# EAGLE schematic ArduinoZeroV4.0 (EAGLE 9.5.1)

## Sheet 1 of 3
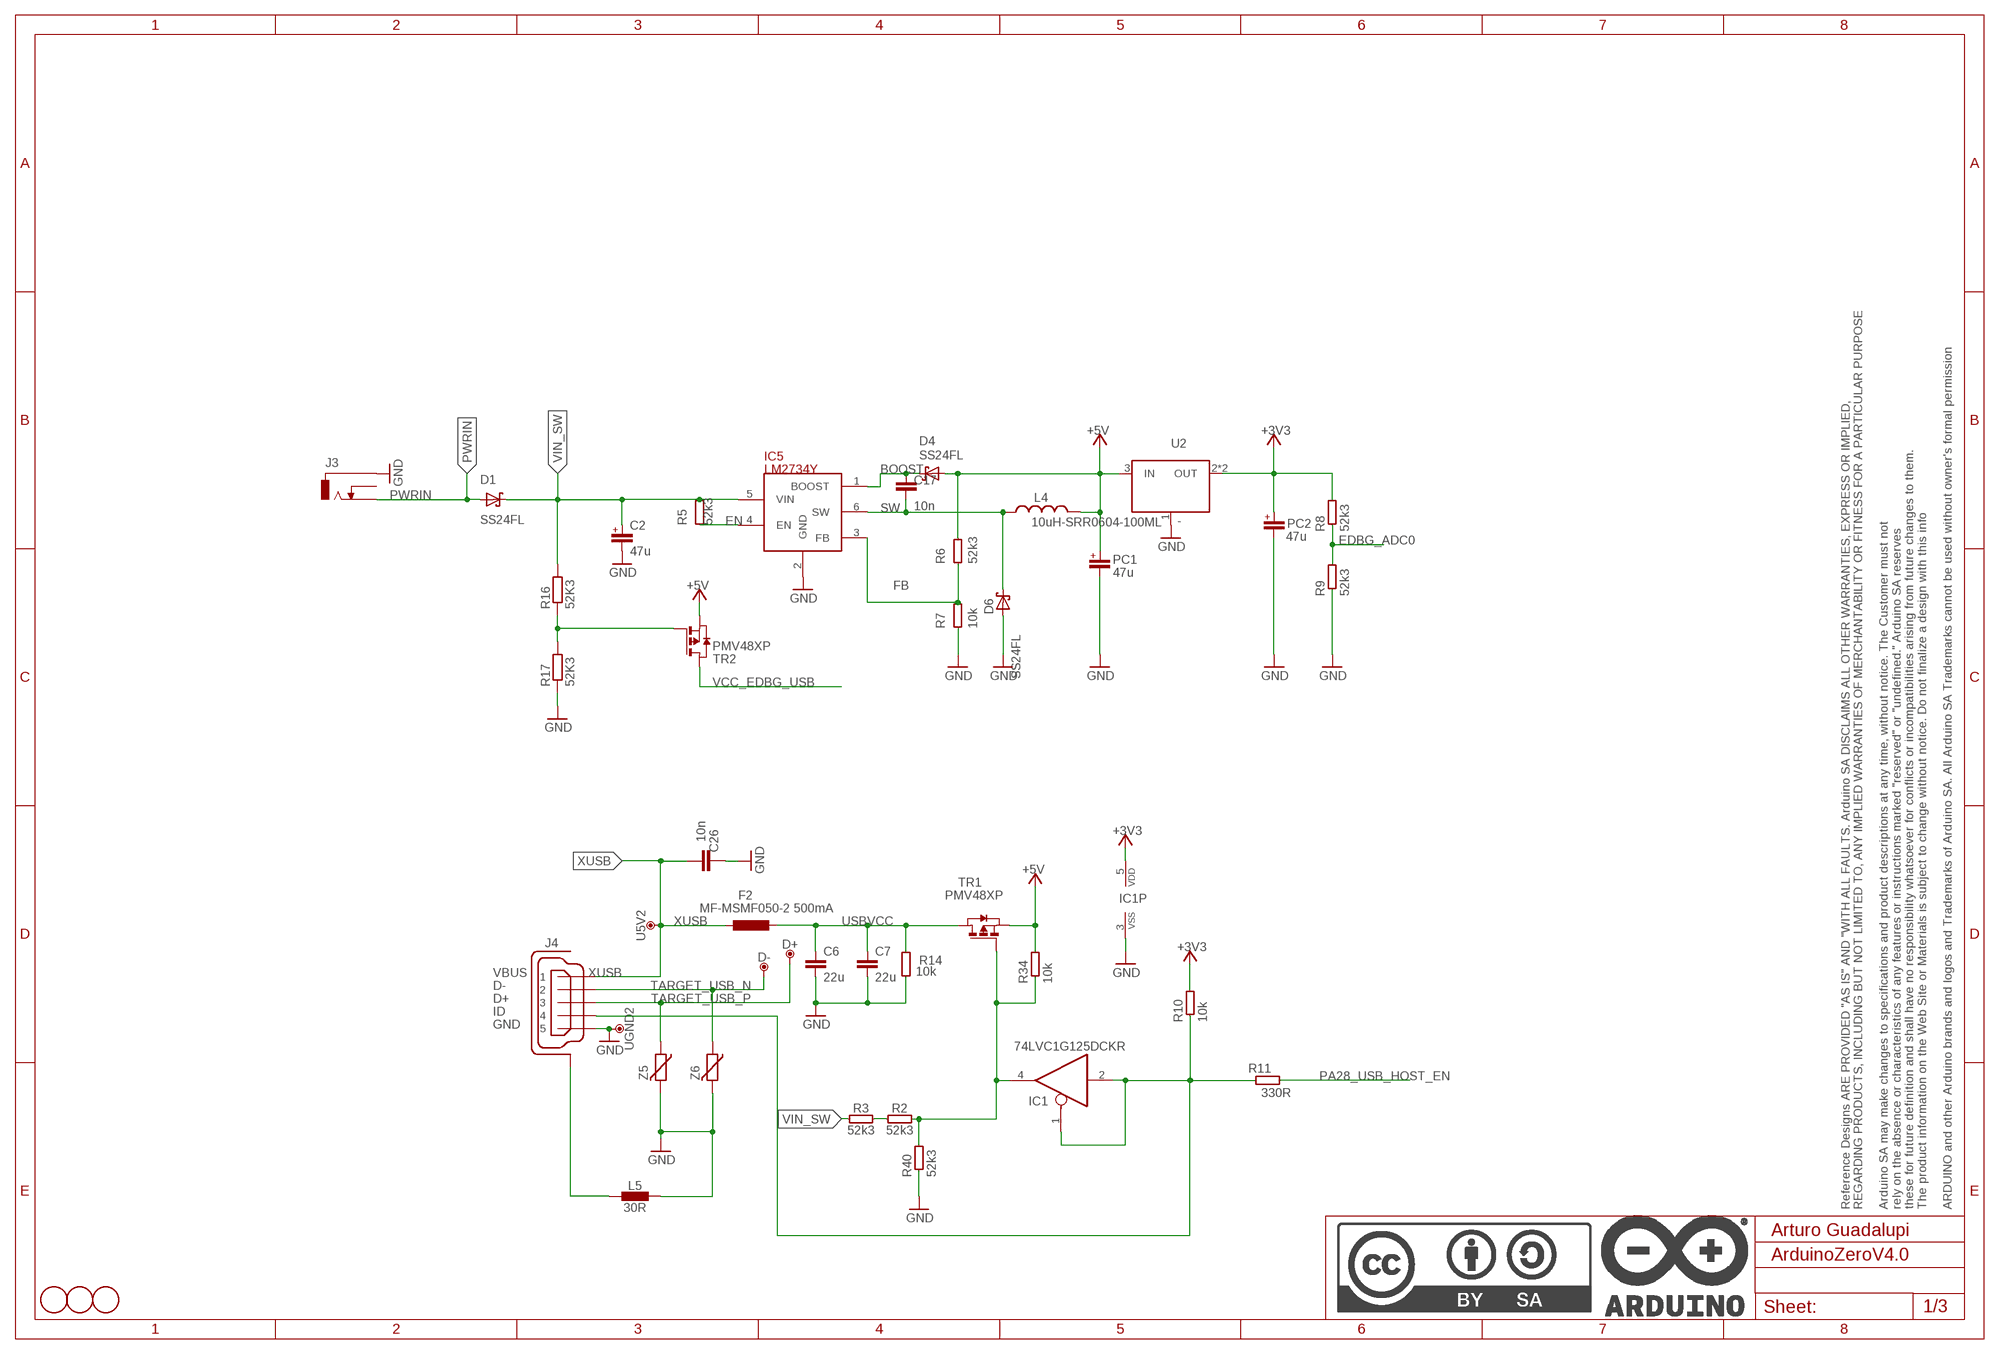
[diagram p0: schematic, sheet 1]

### Parts
C2  47u  C+-47UFPAN-D  [PANASONIC_D]
C6  22u  C-22U-0805  [0805-R2013X50N]
C7  22u  C-22U-0805  [0805-R2013X50N]
C17  10n  C-10NF-0603  [0603-1608X90N]
C26  10n  0142_10NF_0603  [C0603-ROUND]
D1  SS24FL  [SOD123F]
D4  SS24FL  [SOD123F]
D6  SS24FL  [SOD123F]
D+  DNP  TPTP-1.00MM  [TP-1.00MM]
D-  DNP  TPTP-1.00MM  [TP-1.00MM]
F2  MF-MSMF050-2 500mA  0002_MF-MSMF050-2  [L1812]
FD1  DNP  FIDUCIAL-1.5MM  [FD-1-1.5]
FD2  DNP  FIDUCIAL-1.5MM  [FD-1-1.5]
FD3  DNP  FIDUCIAL-1.5MM  [FD-1-1.5]
IC1  74LVC1G125DCKR  SN74LVC1G125DCKR  [SC70-5]
IC5  LM2734Y  0179_LM2734YMK  [SOT23-6]
J3  -  BARRELLG  [POWERSUPPLY_DC-21MM]
J4  -  USB-MICRO  [ZX62-AB-5PA]
L4  10uH-SRR0604-100ML  0031_SRR0604-100ML  [SRR0604]
L5  30R  FERRITE-30R0805  [0805-R2013X50N]
PC1  47u  C+-47UFPAN-D  [PANASONIC_D]
PC2  47u  C+-47UFPAN-D  [PANASONIC_D]
R2  52k3  R-52K3-0603  [C0603]
R3  52k3  R-52K3-0603  [C0603]
R5  52k3  R-52K3-0603  [C0603]
R6  52k3  R-52K3-0603  [C0603]
R7  10k  R-52K3-0603  [C0603]
R8  52k3  R-52K3-0603  [C0603]
R9  52k3  R-52K3-0603  [C0603]
R10  10k  R-10K-0603  [C0603]
R11  330R  R-330R-0603  [C0603]
R14  10k  R-10K-0603  [C0603]
R16  52K3  0180_52K3_0603  [R0603-ROUND]
R17  52K3  0180_52K3_0603  [R0603-ROUND]
R34  10k  R-10K-0603  [C0603]
R40  52k3  R-52K3-0603  [C0603]
TR1  PMV48XP  [SOT-23]
TR2  PMV48XP  [SOT-23]
U2  -  LDO-3.3T3SOT223  [SOT223]
U5V2  DNP  TPTP-1.00MM  [TP-1.00MM]
U$4  DNP  A3-FRAME  [FRAME]
UGND2  DNP  TPTP-1.00MM  [TP-1.00MM]
Z5  -  VARISTOR  [C0603]
Z6  -  VARISTOR  [C0603]

### Nets
+3V3: IC1.5(VDD) PC2.+ R8.2 R10.2 U2.2(OUT) U2.4(OUT) ; also sheet 2,3
+5V [usbvcc]: D4.A L4.P$2 PC1.+ R6.1 R34.2 TR1.2(S) TR2.2(S) U2.3(IN) ; also sheet 2
BOOST: C17.1 D4.C IC5.1(BOOST)
EDBG_ADC0: R8.1 R9.2 ; also sheet 3
EN: IC5.4(EN) R5.2
FB: IC5.3(FB) R6.2 R7.1
GND [gnd]: C2.- C6.2 C7.2 C26.2 D6.A IC1.3(VSS) IC5.2(GND) J3.-1 J3.-2 J3.-3 J4.5 L5.2 PC1.- PC2.- R7.2 R9.1 R14.1 R17.1 R40.1 U2.1(GND/ADJ) UGND2.X Z5.2 Z6.2 ; also sheet 2,3
N$4: IC1.4(O) R2.2 R34.1 R40.2 TR1.3(G)
N$5: R2.1 R3.2
N$7: IC1.1(OE) IC1.2(I) J4.4 R10.1 R11.1
N$15 [gnd]: J4.6(SH) J4.7(SH) J4.8(SH) J4.9(SH) J4.10(SH) J4.11(SH) L5.1
N$16: R16.1 R17.2 TR2.3(G)
PA28_USB_HOST_EN: R11.2 ; also sheet 2
PWRIN [USB]: D1.A J3.+1 J3.+2 J3.+3 ; also sheet 2
SW [USB]: C17.2 D6.C IC5.6(SW) L4.P$1
TARGET_USB_N [USBpair]: D-.X J4.2 Z6.1 ; also sheet 2
TARGET_USB_P [USBpair]: D+.X J4.3 Z5.1 ; also sheet 2
USBVCC [usbvcc]: C6.1 C7.1 F2.1 R14.2 TR1.1(D)
VCC_EDBG_USB: TR2.1(D) ; also sheet 3
VIN_SW [USB]: C2.+ D1.C IC5.5(VIN) R3.1 R5.1 R16.2
XUSB [usbvcc]: C26.1 F2.2 J4.1 U5V2.X
Unconnected: J3.E1 J3.E2 J3.E3

### Notes on the sheet
- Arturo Guadalupi

## Sheet 2 of 3
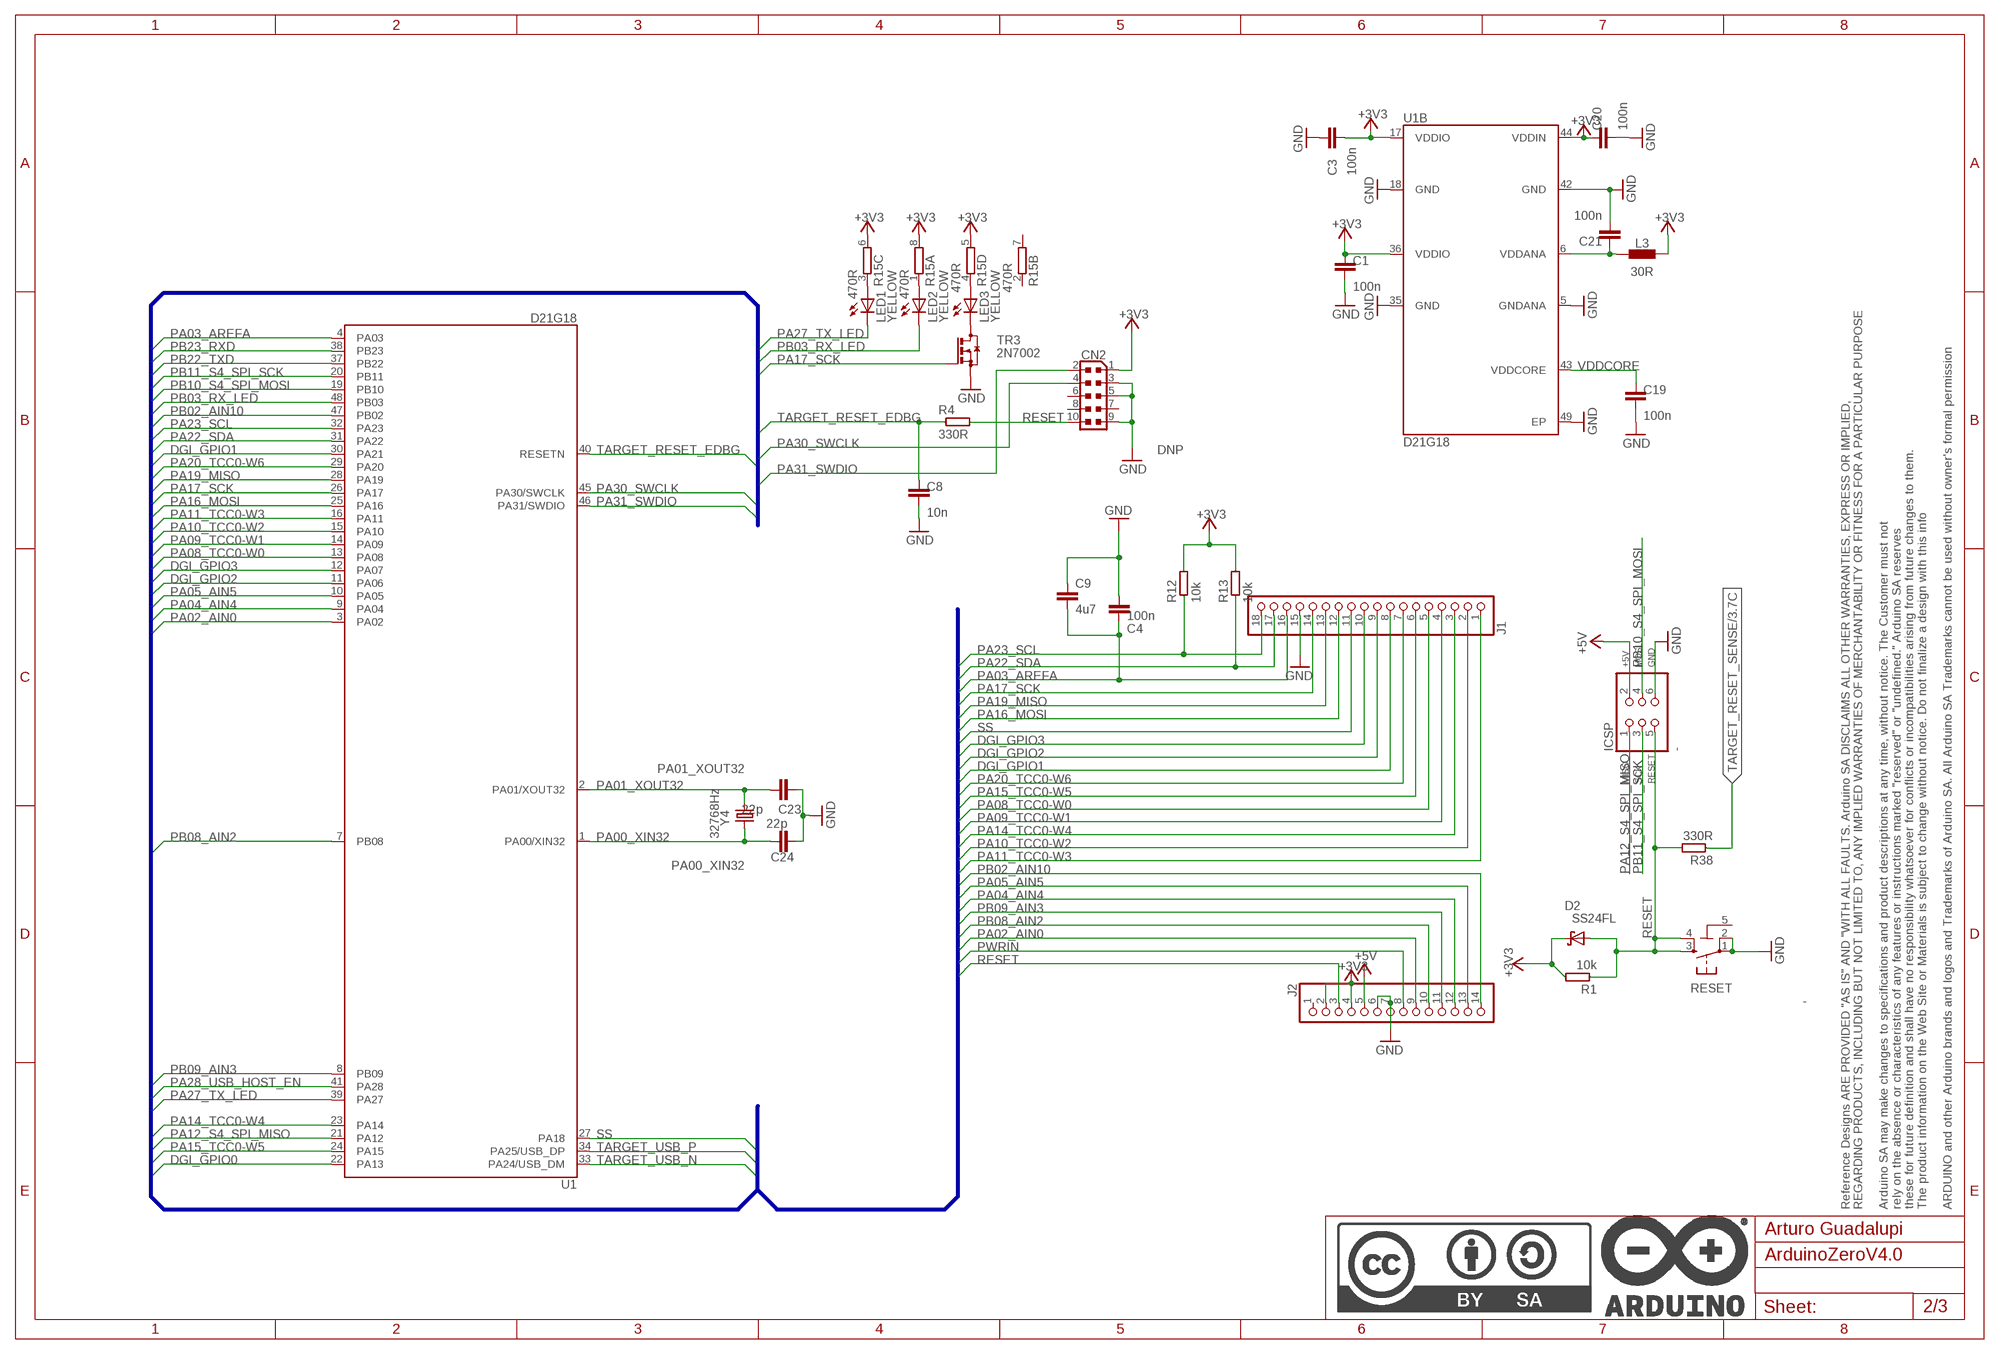
[diagram p1: schematic, sheet 2]

### Parts
C1  100n  C-100NF-0603  [0603-1608X90N]
C3  100n  C-100NF-0603  [0603-1608X90N]
C4  100n  C-100NF-0402  [0402-1005X55N]
C8  10n  C-10NF-0603  [0603-1608X90N]
C9  4u7  C-4.7UF-0603  [0603-1608X90N]
C19  100n  C-100NF-0603  [0603-1608X90N]
C20  100n  C-100NF-0603  [0603-1608X90N]
C21  100n  C-100NF-0603  [0603-1608X90N]
C23  22p  C-22PF-0603  [0603-1608X90N]
C24  22p  C-22PF-0603  [0603-1608X90N]
CN2  DNP  JTAG_CONNECTOR-DNP  [PINHEAD_2X05_127]
D2  SS24FL  [SOD123F]
ICSP  -  PINHD-2X03-ICSPTH  [2X03]
J1  -  PINHD-1X18-FEMALE-CUSTOM_OLD  [1X18-CUSTOM]
J2  -  PINHD-1X14-FEMALE-CUSTOM_OLD  [1X14-CUSTOM]
L3  30R  FERRITE-30R080515MR0805  [0805-R2013X50N]
LED1  YELLOW  LED-YELLOW-0805  [CHIPLED_0805]
LED2  YELLOW  LED-YELLOW-0805  [CHIPLED_0805]
LED3  YELLOW  LED-YELLOW-0805  [CHIPLED_0805]
R1  10k  R-10K-0603  [C0603]
R4  330R  R-330R-0603  [C0603]
R12  10k  R-10K-0603  [C0603]
R13  10k  R-10K-0603  [C0603]
R15  470R  4R-N-470RCAY16  [CAY16]
R38  330R  R-330R-0603  [C0603]
RESET  -  TACTILE2  [TS42]
TR3  2N7002  2N7002T-SOT23-SOT23  [SOT23]
U1  D21G18  ATSAMD21G18A-48QFN  [QFN50P700X700X90-49XN-EPSQ515]
U$5  DNP  A3-FRAME  [FRAME]
Y4  32768Hz  32.768KHZ  [ABS07]

### Nets
+3V3: C1.1 C3.2 C20.1 CN2.1 D2.C J2.2 J2.4 L3.2 R1.2 R12.2 R13.2 R15.5 R15.6 R15.8 U1.17(VDDIO) U1.36(VDDIO) U1.44(VDDIN) ; also sheet 1,3
+5V [usbvcc]: ICSP.2 J2.5 ; also sheet 1
DGI_GPIO0: U1.22(PA13) ; also sheet 3
DGI_GPIO1: J1.8 U1.30(PA21) ; also sheet 3
DGI_GPIO2: J1.9 U1.11(PA06) ; also sheet 3
DGI_GPIO3: J1.10 U1.12(PA07) ; also sheet 3
GND [gnd]: C1.2 C3.1 C4.2 C8.2 C9.1 C19.2 C20.2 C21.2 C23.1 C24.1 CN2.3 CN2.5 CN2.9 ICSP.6 J1.15 J2.6 J2.7 RESET.1 RESET.2 TR3.2(S) U1.5(GNDANA) U1.18(GND) U1.35(GND) U1.42(GND) U1.49(EP) ; also sheet 1,3
N$3: LED3.C TR3.3(D)
N$10: C21.1 L3.1 U1.6(VDDANA)
N$20: LED1.A R15.3
N$21: LED2.A R15.1
N$22: LED3.A R15.4
PA00_XIN32: C24.2 U1.1(PA00/XIN32) Y4.1
PA01_XOUT32: C23.2 U1.2(PA01/XOUT32) Y4.2
PA02_AIN0: J2.9 U1.3(PA02)
PA03_AREFA: C4.1 C9.2 J1.16 U1.4(PA03)
PA04_AIN4: J2.12 U1.9(PA04)
PA05_AIN5: J2.13 U1.10(PA05)
PA08_TCC0-W0: J1.5 U1.13(PA08)
PA09_TCC0-W1: J1.4 U1.14(PA09)
PA10_TCC0-W2: J1.2 U1.15(PA10)
PA11_TCC0-W3: J1.1 U1.16(PA11)
PA12_S4_SPI_MISO: ICSP.1 U1.21(PA12)
PA14_TCC0-W4: J1.3 U1.23(PA14)
PA15_TCC0-W5: J1.6 U1.24(PA15)
PA16_MOSI: J1.12 U1.25(PA16) ; also sheet 3
PA17_SCK: J1.14 TR3.1(G) U1.26(PA17) ; also sheet 3
PA19_MISO: J1.13 U1.28(PA19) ; also sheet 3
PA20_TCC0-W6: J1.7 U1.29(PA20)
PA22_SDA: J1.17 R13.1 U1.31(PA22) ; also sheet 3
PA23_SCL: J1.18 R12.1 U1.32(PA23) ; also sheet 3
PA27_TX_LED: LED1.C U1.39(PA27)
PA28_USB_HOST_EN: U1.41(PA28) ; also sheet 1
PA30_SWCLK: CN2.4 U1.45(PA30/SWCLK) ; also sheet 3
PA31_SWDIO: CN2.2 U1.46(PA31/SWDIO) ; also sheet 3
PB02_AIN10: J2.14 U1.47(PB02)
PB03_RX_LED: LED2.C U1.48(PB03)
PB08_AIN2: J2.10 U1.7(PB08)
PB09_AIN3: J2.11 U1.8(PB09)
PB10_S4_SPI_MOSI: ICSP.4 U1.19(PB10)
PB11_S4_SPI_SCK: ICSP.3 U1.20(PB11)
PB22_TXD: U1.37(PB22) ; also sheet 3
PB23_RXD: U1.38(PB23) ; also sheet 3
PWRIN [USB]: J2.8 ; also sheet 1
RESET: CN2.10 D2.A ICSP.5 J2.3 R1.1 R4.2 R38.2 RESET.3 RESET.4
SS: J1.11 U1.27(PA18) ; also sheet 3
TARGET_RESET_EDBG: C8.1 R4.1 U1.40(RESETN) ; also sheet 3
TARGET_RESET_SENSE: R38.1 ; also sheet 3
TARGET_USB_N [USBpair]: U1.33(PA24/USB_DM) ; also sheet 1
TARGET_USB_P [USBpair]: U1.34(PA25/USB_DP) ; also sheet 1
VDDCORE: C19.1 U1.43(VDDCORE)
Unconnected: CN2.6 CN2.7 CN2.8 J2.1 R15.2 R15.7

### Buses
+3V3,+5V,BD-,BD+,BOOST,DGI_GPIO0,DGI_GPIO1,DGI_GPIO2,DGI_GPIO3,EDBG_ADC0,EDBG_FORCE_BOOT,EN,FB,GND,N$1,N$2,N$3,N$4,N$6,N$7,N$10,N$15,N$16,N$18,N$19,N$20,N$21,N$22,N$23,N$24,N$25,N$26,N$27,N$34,N$37,N$38,N$39,N$40,N$41,N$42,N$43,N$44,N$45,N$57,N$58,N$59,N$60,N$61,N$67,N$68,PA00_XIN32,PA01_XOUT32,PA02_AIN0,PA03_AREFA,PA04_AIN4,PA05_AIN5,PA08_TCC0-W0,PA09_TCC0-W1,PA10_TCC0-W2,PA11_TCC0-W3,PA12_S4_SPI_MISO,PA14_TCC0-W4,PA15_TCC0-W5,PA16_MOSI,PA17_SCK,PA19_MISO,PA20_TCC0-W6,PA22_SDA,PA23_SCL,PA27_TX_LED,PA28_USB_HOST_EN,PA30_SWCLK,PA31_SWDIO,PB02_AIN10,PB03_RX_LED,PB08_AIN2,PB09_AIN3,PB10_S4_SPI_MOSI,PB11_S4_SPI_SCK,PB22_TXD,PB23_RXD,POWER_LED_CTRL,PWRIN,RESET,SS,STATUS_LED_CTRL,SW,TARGET_RESET_EDBG,TARGET_RESET_SENSE,TARGET_USB_N,TARGET_USB_P,USBVCC,VCC_EDBG_3V3,VCC_EDBG_USB,VDDCORE,VIN_SW,XUSB,XVCC

### Notes on the sheet
- Arturo Guadalupi

## Sheet 3 of 3
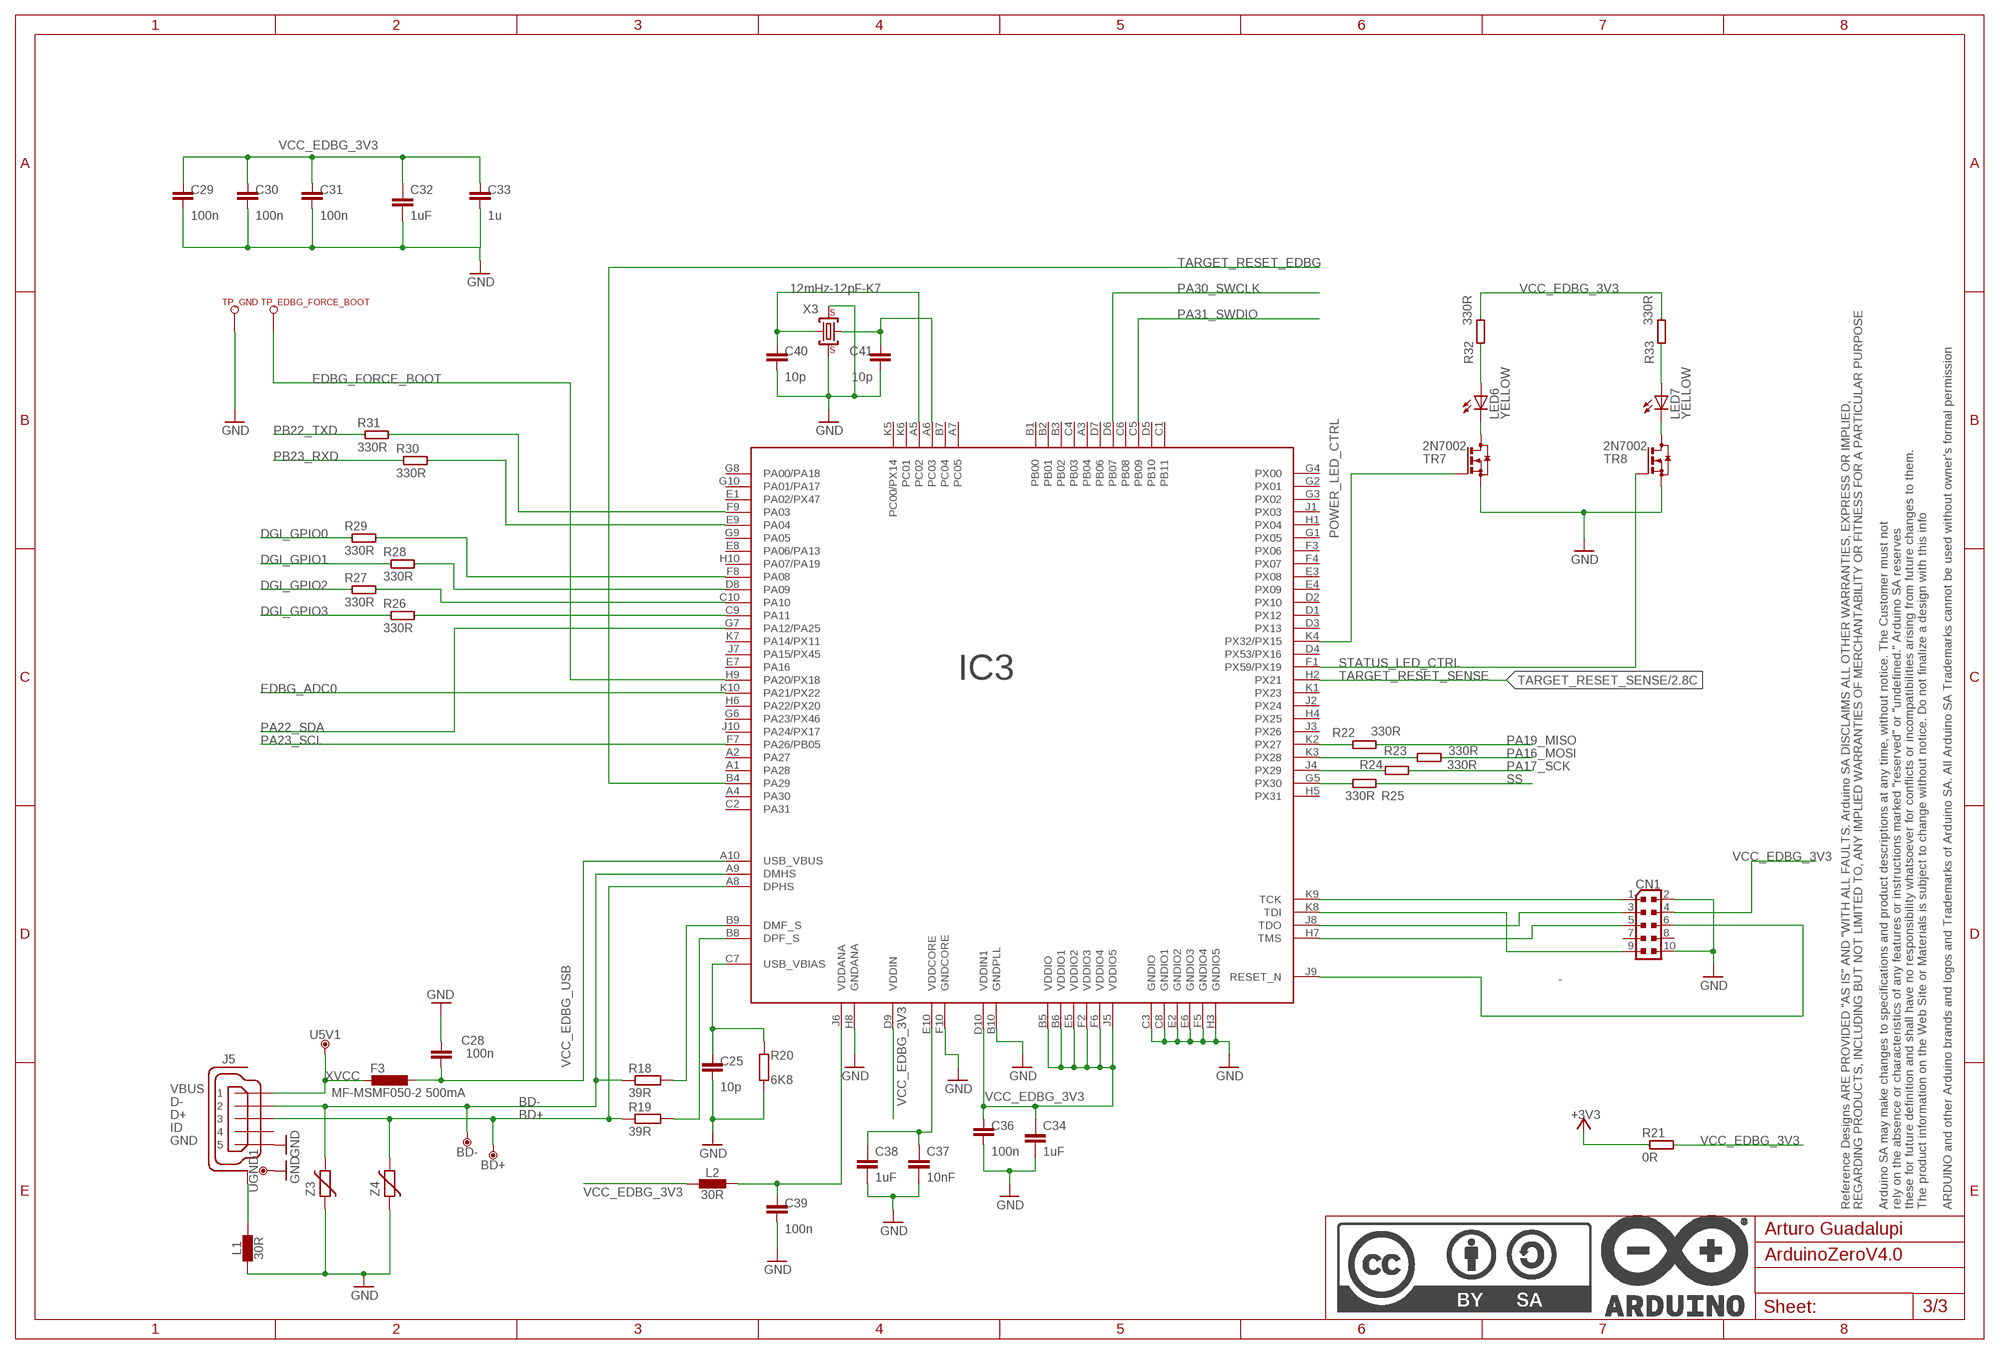
[diagram p2: schematic, sheet 3]

### Parts
BD+  DNP  TPTP-1.00MM  [TP-1.00MM]
BD-  DNP  TPTP-1.00MM  [TP-1.00MM]
C25  10p  C-10P-0603  [0603-1608X90N]
C28  100n  C-100NF-0603  [0603-1608X90N]
C29  100n  C-100NF-0603  [0603-1608X90N]
C30  100n  C-100NF-0603  [0603-1608X90N]
C31  100n  C-100NF-0603  [0603-1608X90N]
C32  1uF  0006_1UF_0603/GRM188R61E105KA12D  [C0603-ROUND]
C33  1u  C-1UF-0603  [0603-1608X90N]
C34  1uF  0006_1UF_0603/GRM188R61E105KA12D  [C0603-ROUND]
C36  100n  C-100NF-0603  [0603-1608X90N]
C37  10nF  0408_1NF_0603  [C0603-ROUND]
C38  1uF  0006_1UF_0603/GRM188R61E105KA12D  [C0603-ROUND]
C39  100n  C-100NF-0603  [0603-1608X90N]
C40  10p  C-10P-0603  [0603-1608X90N]
C41  10p  C-10P-0603  [0603-1608X90N]
CN1  -  JTAG_CONNECTOR-ROUND  [PINHEAD_2X05_127]
F3  MF-MSMF050-2 500mA  0002_MF-MSMF050-2  [L1812]
IC3  1791_AT32UC3A4256HHB-C1UR  [VFBGA100]
J5  -  USB-MICRO  [ZX62-AB-5PA]
L1  30R  FERRITE-30R080515MR0805  [0805-R2013X50N]
L2  30R  FERRITE-30R080515MR0805  [0805-R2013X50N]
LED6  YELLOW  LED-YELLOW-0805  [CHIPLED_0805]
LED7  YELLOW  LED-YELLOW-0805  [CHIPLED_0805]
R18  39R  0176_39_R_0603  [R0603-ROUND]
R19  39R  0176_39_R_0603  [R0603-ROUND]
R20  6K8  0164_6K8_0603  [R0603-ROUND]
R21  0R  R-0R-0603  [C0603]
R22  330R  R-330R-0603  [C0603]
R23  330R  R-330R-0603  [C0603]
R24  330R  R-330R-0603  [C0603]
R25  330R  R-330R-0603  [C0603]
R26  330R  R-330R-0603  [C0603]
R27  330R  R-330R-0603  [C0603]
R28  330R  R-330R-0603  [C0603]
R29  330R  R-330R-0603  [C0603]
R30  330R  R-330R-0603  [C0603]
R31  330R  R-330R-0603  [C0603]
R32  330R  R-330R-0603  [C0603]
R33  330R  R-330R-0603  [C0603]
TP_EDBG_FORCE_BOOT  TP_SP  [TP-SP]
TP_GND  TP_SP  [TP-SP]
TR7  2N7002  2N7002T-SOT23-SOT23  [SOT23]
TR8  2N7002  2N7002T-SOT23-SOT23  [SOT23]
U5V1  DNP  TPTP-1.00MM  [TP-1.00MM]
U$6  DNP  A3-FRAME  [FRAME]
UGND1  DNP  TPTP-1.00MM  [TP-1.00MM]
X3  12mHz-12pF-K7  0396_12MHZ-12PF-K7  [CRYSTAL-3.2-2.5]
Z3  -  VARISTOR  [C0603]
Z4  -  VARISTOR  [C0603]

### Nets
+3V3: R21.1 ; also sheet 1,2
BD+ [USBpair]: BD+.X IC3.A8(DPHS) J5.3 R19.1 Z4.2
BD- [USBpair]: BD-.X IC3.A9(DMHS) J5.2 R18.1 Z3.2
DGI_GPIO0: R29.1 ; also sheet 2
DGI_GPIO1: R28.1 ; also sheet 2
DGI_GPIO2: R27.1 ; also sheet 2
DGI_GPIO3: R26.1 ; also sheet 2
EDBG_ADC0: IC3.K10(PA21/PX22) ; also sheet 1
EDBG_FORCE_BOOT: IC3.H9(PA20/PX18) TP_EDBG_FORCE_BOOT.X(TESTP)
GND [gnd]: C25.2 C28.2 C29.2 C30.2 C31.2 C32.2 C33.2 C34.2 C36.2 C37.2 C38.2 C39.2 C40.2 C41.2 CN1.2 CN1.10 IC3.B10(GNDPLL) IC3.C3(GNDIO) IC3.C8(GNDIO1) IC3.E2(GNDIO2) IC3.E6(GNDIO3) IC3.F5(GNDIO4) IC3.F10(GNDCORE) IC3.H3(GNDIO5) IC3.H8(GNDANA) J5.5 L1.1 R20.1 TP_GND.X(TESTP) TR7.2(S) TR8.2(S) UGND1.X X3.2(GND) X3.4(GND) Z3.1 Z4.1 ; also sheet 1,2
N$1: LED6.C TR7.3(D)
N$2: LED7.C TR8.3(D)
N$6 [gnd]: J5.6(SH) J5.7(SH) J5.8(SH) J5.9(SH) J5.10(SH) J5.11(SH) L1.2
N$18: IC3.B9(DMF_S) R18.2
N$19: IC3.B8(DPF_S) R19.2
N$23: C25.1 IC3.C7(USB_VBIAS) R20.2
N$24: C41.1 IC3.A6(PC03) X3.1(C1)
N$25: C40.1 IC3.A5(PC02) X3.3(C2)
N$26: C37.1 C38.1 IC3.E10(VDDCORE)
N$27: C39.1 IC3.J6(VDDANA) L2.2
N$34: IC3.K2(PX27) R22.1
N$37: IC3.K3(PX28) R23.1
N$38: IC3.J4(PX29) R24.1
N$39: IC3.G5(PX30) R25.1
N$40: IC3.C9(PA11) R26.2
N$41: IC3.C10(PA10) R27.2
N$42: IC3.D8(PA09) R28.2
N$43: IC3.F8(PA08) R29.2
N$44: IC3.E9(PA04) R30.2
N$45: IC3.F9(PA03) R31.2
N$57: CN1.1 IC3.K9(TCK)
N$58: CN1.9 IC3.K8(TDI)
N$59: CN1.3 IC3.J8(TDO)
N$60: CN1.5 IC3.H7(TMS)
N$61: CN1.6 IC3.J9(RESET_N)
N$67: LED6.A R32.1
N$68: LED7.A R33.1
PA16_MOSI: R23.2 ; also sheet 2
PA17_SCK: R24.2 ; also sheet 2
PA19_MISO: R22.2 ; also sheet 2
PA22_SDA: IC3.G7(PA12/PA25) ; also sheet 2
PA23_SCL: IC3.F7(PA26/PB05) ; also sheet 2
PA30_SWCLK: IC3.D6(PB07) ; also sheet 2
PA31_SWDIO: IC3.C5(PB09) ; also sheet 2
PB22_TXD: R31.1 ; also sheet 2
PB23_RXD: R30.1 ; also sheet 2
POWER_LED_CTRL: IC3.K4(PX32/PX15) TR7.1(G)
SS: R25.2 ; also sheet 2
STATUS_LED_CTRL: IC3.F1(PX59/PX19) TR8.1(G)
TARGET_RESET_EDBG: IC3.B4(PA29) ; also sheet 2
TARGET_RESET_SENSE: IC3.H2(PX21) ; also sheet 2
VCC_EDBG_3V3: C29.1 C30.1 C31.1 C32.1 C33.1 C34.1 C36.1 CN1.4 IC3.B5(VDDIO) IC3.B6(VDDIO1) IC3.D9(VDDIN) IC3.D10(VDDIN1) IC3.E5(VDDIO2) IC3.F2(VDDIO3) IC3.F6(VDDIO4) IC3.J5(VDDIO5) L2.1 R21.2 R32.2 R33.2
VCC_EDBG_USB: C28.1 F3.1 IC3.A10(USB_VBUS) ; also sheet 1
XVCC [usbvcc]: F3.2 J5.1 U5V1.X
Unconnected: CN1.7 CN1.8 IC3.A1(PA28) IC3.A2(PA27) IC3.A3(PB04) IC3.A4(PA30) IC3.A7(PC05) IC3.B1(PB00) IC3.B2(PB01) IC3.B3(PB02) IC3.B7(PC04) IC3.C1(PB11) IC3.C2(PA31) IC3.C4(PB03) IC3.C6(PB08) IC3.D1(PX12) IC3.D2(PX10) IC3.D3(PX13) IC3.D4(PX53/PX16) IC3.D5(PB10) IC3.D7(PB06) IC3.E1(PA02/PX47) IC3.E3(PX08) IC3.E4(PX09) IC3.E7(PA16) IC3.E8(PA06/PA13) IC3.F3(PX06) IC3.F4(PX07) IC3.G1(PX05) IC3.G2(PX01) IC3.G3(PX02) IC3.G4(PX00) IC3.G6(PA23/PX46) IC3.G8(PA00/PA18) IC3.G9(PA05) IC3.G10(PA01/PA17) IC3.H1(PX04) IC3.H4(PX25) IC3.H5(PX31) IC3.H6(PA22/PX20) IC3.H10(PA07/PA19) IC3.J1(PX03) IC3.J2(PX24) IC3.J3(PX26) IC3.J7(PA15/PX45) IC3.J10(PA24/PX17) IC3.K1(PX23) IC3.K5(PC00/PX14) IC3.K6(PC01) IC3.K7(PA14/PX11) J5.4

### Notes on the sheet
- Arturo Guadalupi

## Power pins joined to a net without a drawn wire
5-GND: RESET.5(5-GND)

## Library data of the parts
BD+ BD- D+ D- U5V1 U5V2 UGND1 UGND2 = Arduino-utility:TP: Testpoint; CODE-ARDUINO: DNP; DATASHEET: DNP; DISTRIBUTOR-LINK: DNP; DISTRIBUTOR-PN: DNP; MANUFACTURER: DNP; MANUFACTURER-PN: DNP
C1 C3 C19-C21 C28-C31 C36 C39 = Arduino-rcl:C: SMD Capacitor; CODE-ARDUINO: 0015; DATASHEET: http://search.murata.co.jp/Ceramy/image/img/A01X/G101/ENG/GRM188R71C104KA01-01.pdf; DISTRIBUTOR-LINK: https://www.digikey.com/product-detail/en/murata-electronics-north-america/GRM188R71C104KA01D/490-1532-1-ND/587771; DISTRIBUTOR-PN: 490-1532-2-ND; MANUFACTURER: Murata; MANUFACTURER-PN: GRM188R71C104KA01D; NOTE: -; PN-ALTERNATIVE1: NMC0603Y5V104Z25TRPF; PN-ALTERNATIVE2: C1608F104Z500NT; PN-ALTERNATIVE3: C0603C104K3RAC7411; PN-ALTERNATIVE4: 06035D104KAT2A; PN-ALTERNATIVE5: 0603B104K500CT
C2 PC1 PC2 = Arduino-rcl:C+: Polarized Capacitor; CODE-ARDUINO: 0113; DATASHEET: https://industrial.panasonic.com/cdbs/www-data/pdf/RDE0000/DME0000COL90.pdf; DISTRIBUTOR-LINK: https://www.digikey.com/product-detail/en/panasonic-electronic-components/EEE-1EA470WP/PCE3908CT-ND/766284; DISTRIBUTOR-PN: PCE3908CT-ND; MANUFACTURER: Panasonic; MANUFACTURER-PN: EEE-1EA470WP; PN-ALTERNATIVE1: TS13C01E470MET000R
C4 = Arduino-rcl:C: SMD Capacitor; CODE-ARDUINO: 0132; DATASHEET: http://www.tdk.com/pdf/TDKMLCCCapRange.pdf; DISTRIBUTOR-LINK: http://www.digikey.com/product-detail/en/tdk-corporation/C1005X5R1H104K050BB/445-5942-1-ND/2443982; DISTRIBUTOR-PN: 445-5942-1-ND; MANUFACTURER: TDK; MANUFACTURER-PN: C1005X5R1H104K050BB; NOTE: -
C6 C7 = Arduino-rcl:C: SMD Capacitor; CODE-ARDUINO: 2233; DATASHEET: https://media.digikey.com/pdf/Data%20Sheets/Samsung%20PDFs/CL21A226MQCLQNC_character.pdf; DISTRIBUTOR-LINK: https://www.digikey.com/product-detail/en/samsung-electro-mechanics-america-inc/CL21A226MQCLQNC/1276-2412-1-ND/3890498; DISTRIBUTOR-PN: 1276-2412-1-ND; MANUFACTURER: Samsung; MANUFACTURER-PN: CL21A226MQCLQNC; NOTE: -
C8 C17 = Arduino-rcl:C: SMD Capacitor; CODE-ARDUINO: 0142; DATASHEET: http://www.murata.com/~/media/webrenewal/support/library/catalog/products/capacitor/mlcc/c02e.pdf; DISTRIBUTOR-LINK: https://www.digikey.com/product-detail/en/murata-electronics-north-america/GRM188R71H103KA01D/490-1512-1-ND/587862; DISTRIBUTOR-PN: 490-1512-1-ND; MANUFACTURER: Murata; MANUFACTURER-PN: GRM188R71H103KA01D; NOTE: -
C9 = Arduino-rcl:C: SMD Capacitor; CODE-ARDUINO: 0458; DATASHEET: http://www.murata.com/~/media/webrenewal/support/library/catalog/products/capacitor/mlcc/c02e.pdf; DISTRIBUTOR-LINK: http://www.digikey.com/product-search/en?keywords=490-7203-1-ND; DISTRIBUTOR-PN: 490-7203-1-ND; MANUFACTURER: Murata; MANUFACTURER-PN: GRM188R61E475KE11D; NOTE: -
C23 C24 = Arduino-rcl:C: SMD Capacitor; CODE-ARDUINO: 0014; DATASHEET: http://www.samsungsem.com/kr/support/product-search/mlcc/__icsFiles/afieldfile/2016/08/18/S_CL10C220JB8NNNC.pdf; DISTRIBUTOR-LINK: https://www.digikey.com/product-detail/en/samsung-electro-mechanics-america-inc/CL10C220JB8NNNC/1276-1023-1-ND/3889109; DISTRIBUTOR-PN: 1276-1023-1-ND; MANUFACTURER: Samsung; MANUFACTURER-PN: CL10C220JB8NNNC; NOTE: -; PN-ALTERNATIVE1: 0603N220J500CT
C25 C40 C41 = Arduino-rcl:C: SMD Capacitor; CODE-ARDUINO: A5144; DATASHEET: -; DISTRIBUTOR-LINK: -; DISTRIBUTOR-PN: -; MANUFACTURER: -; MANUFACTURER-PN: -; NOTE: -
C26 = Condensatori:0142_10NF_0603: 10nF 0603; CASE: 0603; MONTHLY_USAGE: _____; PART_NUMBER: 10nF_0603; PRICE: _____; SUPPLIER: _____; TYPE: Condensatori; VALUE: 10nF
C32 C34 C38 = Condensatori:0006_1UF_0603/GRM188R61E105KA12D: 1uF 0603; CASE: 0603; MONTHLY_USAGE: _____; PART_NUMBER: 1uF_0603/GRM188R61E105KA12D; PRICE: _____; SUPPLIER: _____; TYPE: Condensatori
C33 = Arduino-rcl:C: SMD Capacitor; CODE-ARDUINO: 0006; DATASHEET: http://www.samsungsem.com/kr/support/product-search/mlcc/__icsFiles/afieldfile/2016/08/18/S_CL10B105KP8NNNC.pdf; DISTRIBUTOR-LINK: https://www.digikey.com/product-detail/en/samsung-electro-mechanics-america-inc/CL10B105KP8NNNC/1276-1946-1-ND/3890032; DISTRIBUTOR-PN: 1276-1946-1-ND; MANUFACTURER: Samsung; MANUFACTURER-PN: CL10B105KP8NNNC; NOTE: -; PN-ALTERNATIVE1: 0603X105K250CT
C37 = Condensatori:0408_1NF_0603: 1nF 0603; CASE: 0603; MONTHLY_USAGE: _____; PART_NUMBER: 1nF_0603; PRICE: _____; SUPPLIER: _____; TYPE: Condensatori; VALUE: 1nF
CN1 = Arduino-connectors:JTAG_CONNECTOR: 2x5 PASSO 1,27; CODE-ARDUINO: 0171; DATASHEET: -; DISTRIBUTOR-LINK: -; DISTRIBUTOR-PN: -; MANUFACTURER: -; MANUFACTURER-PN: -
CN2 = Arduino-connectors:JTAG_CONNECTOR: 2x5 PASSO 1,27; CODE-ARDUINO: DNP; DATASHEET: DNP; DISTRIBUTOR-LINK: DNP; DISTRIBUTOR-PN: DNP; MANUFACTURER: DNP; MANUFACTURER-PN: DNP
D1 D2 D4 D6 = Arduino-diodes:SS24FL: Schottky diode; CODE-ARDUINO: 0025; DATASHEET: https://www.fairchildsemi.com/datasheets/SS/SS24FL.pdf; DISTRIBUTOR-LINK: https://www.digikey.com/product-detail/en/fairchild-on-semiconductor/SS24FL/SS24FLCT-ND/5305093; DISTRIBUTOR-PN: SS24FLCT-ND; MANUFACTURER: Fairchild; MANUFACTURER-PN: SS24FL
F2 F3 = Protezione:0002_MF-MSMF050-2: 500 mA Multifuse � Polyfuse; MONTHLY_USAGE: _____; PART_NUMBER: MF-MSMF050-2; PRICE: _____; SUPPLIER: _____; TYPE: Protezione
FD1-FD3 = Arduino-utility:FIDUCIAL: Fiducial mount; CODE-ARDUINO: DNP; DATASHEET: DNP; DISTRIBUTOR-LINK: DNP; DISTRIBUTOR-PN: DNP; MANUFACTURER: DNP; MANUFACTURER-PN: DNP
IC1 = Arduino-ICs:SN74LVC1G125DCKR: Single bus buffer with 3-state output; CODE-ARDUINO: 0040; DATASHEET: http://www.ti.com/lit/ds/symlink/sn74lvc1g125.pdf; DISTRIBUTOR-LINK: https://www.digikey.com/product-detail/en/texas-instruments/SN74LVC1G125DCKR/296-11604-1-ND/385743; DISTRIBUTOR-PN: 296-11604-1-ND; MANUFACTURER: Texas Instruments; MANUFACTURER-PN: SN74LVC1G125DCKR; NOTE: NO
IC3 = IntegratedCircuits:1791_AT32UC3A4256HHB-C1UR: ATMEL 32-bit AVR Microcontroller - VFBGA100
IC5 = Circuito Integrato:0179_LM2734YMK: 1A Load Step-Down DC-DC Regulator - LM2734Y Switching; CASE: SOT23-5; MONTHLY_USAGE: _____; PART_NUMBER: LM2734YMK; PRICE: _____; SUPPLIER: _____; TYPE: Circuito_Integrato; VALUE: LM2734YMK
ICSP = Arduino-connectors:PINHD-2X03-ICSP: PIN HEADER; CODE-ARDUINO: 0114; DATASHEET: -; DISTRIBUTOR-LINK: https://www.digikey.com/product-detail/en/samtec-inc/TSW-103-25-S-D/TSW-103-25-S-D-ND/7863771; DISTRIBUTOR-PN: TSW-103-25-S-D-ND; MANUFACTURER: Samtec; MANUFACTURER-PN: TSW-103-25-S-D
J1 = Arduino-connectors:PINHD-1X18: Pin header; CODE-ARDUINO: 3648; DATASHEET: -; DISTRIBUTOR-LINK: -; DISTRIBUTOR-PN: -; MANUFACTURER-PN: -; MANUFCATURER: -; NOTE: -
J2 = Arduino-connectors:PINHD-1X14: PIN HEADER; CODE-ARDUINO: 3649; DATASHEET: -; DISTRIBUTOR-LINK: -; DISTRIBUTOR-PN: -; MANUFACTURER: -; MANUFACTURER-PN: -; NOTE: -
J3 = Arduino-connectors:BARREL: Power Barrel Connector Jack 2.10mm ID (0.083"), 5.50mm OD (0.217") Through Hole, Right Angle; CODE-ARDUINO: 0018; DATASHEET: http://www.mouser.com/ds/2/253/KC-301287-195995.pdf; DISTRIBUTOR-LINK: https://www.mouser.it/ProductDetail/Kobiconn/163-179PH-EX/?qs=Xb8IjHhkxj5l2UOaIqcGCw==; DISTRIBUTOR-PN: 163-179PH-EX; MANUFACTURER: Kobiconn; MANUFACTURER-PN: 163-179PH-EX
J4 J5 = Arduino-connectors:USB-MICRO: USB - micro AB USB 2.0 Receptacle Connector 5 Position Surface Mount, Right Angle, Horizontal; CODE-ARDUINO: 2219; DATASHEET: https://www.hirose.com/product/en/download_file/key_name/ZX/category/Catalog/doc_file_id/31704/?file_category_id=4&item_id=13&is_series=1; DISTRIBUTOR-LINK: http://www.digikey.com/product-detail/en/hirose-electric-co-ltd/ZX62-AB-5PA(31)/H125279CT-ND/5994741; DISTRIBUTOR-PN: H125279CT-ND; MANUFACTURER: Hirose; MANUFACTURER-PN: ZX62-AB-5PA(31)
L1-L3 = Arduino-rcl:FERRITE: SMD ferrite; CODE-ARDUINO: 0001; DATASHEET: https://www.murata.com/en-us/products/productdata/8796738977822/ENFA0005.pdf; DISTRIBUTOR-LINK: https://www.digikey.it/product-detail/en/murata-electronics-north-america/BLM21PG300SN1D/490-1052-1-ND/584499; DISTRIBUTOR-PN: 490-1052-1-ND; MANUFACTURER: Murata; MANUFACTURER-PN: BLM21PG300SN1D; PN-ALTERNATIVE1: MH2029-300Y
L4 = Induttanze:0031_SRR0604-100ML: SRR0604-100ML; CASE: SMD_6,5x6,5; MONTHLY_USAGE: _____; PART_NUMBER: SRR0604-100ML; PRICE: _____; SUPPLIER: _____; TYPE: Induttanze
L5 = Arduino-rcl:FERRITE: SMD ferrite; CODE-ARDUINO: 0001; DATASHEET: https://media.digikey.com/pdf/Data%20Sheets/Samsung%20PDFs/Chip_Inductor_Catalog_2014.pdf; DISTRIBUTOR-LINK: https://www.digikey.com/products/en?keywords=CIB21P300NE; DISTRIBUTOR-PN: CIB21P300NE-ND; MANUFACTURER: Samsung; MANUFACTURER-PN: CIB21P300NE
LED1-LED3 LED6 LED7 = Arduino-diodes:LED: LED; CODE-ARDUINO: 0044; DATASHEET: https://media.digikey.com/pdf/Data%20Sheets/Lite-On%20PDFs/LTST-C170GKT.pdf; DISTRIBUTOR-LINK: https://www.digikey.com/product-detail/it/lite-on-inc/LTST-C170YKT/160-1175-1-ND/269247; DISTRIBUTOR-PN: 160-1175-1-ND; MANUFACTURER: Lite-On; MANUFACTURER-PN: LTST-C170YKT; PN-ALTERNATIVE1: KPT-2012YC
R1 R10 R12-R14 R34 = Arduino-rcl:R: SMD Resistor; CODE-ARDUINO: 0028; DATASHEET: http://www.yageo.com/documents/recent/PYu-RC_Group_51_RoHS_L_8.pdf; DISTRIBUTOR-LINK: https://www.digikey.com/product-detail/en/yageo/RC0603JR-0710KL/311-10KGRCT-ND/729647; DISTRIBUTOR-PN: 311-10KGRCT-ND; MANUFACTURER: Yageo; MANUFACTURER-PN: RC0603JR-0710KL; NOTE: NO; PN-ALTERNATIVE1: -
R2 R3 R5 R6 R8 R9 R40 = Arduino-rcl:R: SMD Resistor; CODE-ARDUINO: A5459; DATASHEET: https://industrial.panasonic.com/cdbs/www-data/pdf/RDA0000/AOA0000C304.pdf; DISTRIBUTOR-LINK: https://www.digikey.com/product-detail/en/yageo/RC0603FR-0752K3L/311-52.3KHRCT-ND/730237; DISTRIBUTOR-PN: 311-52.3KHRCT-ND; MANUFACTURER: Yageo; MANUFACTURER-PN: RC0603FR-0752K3L; NOTE: 1% ONLY; PN-ALTERNATIVE1: -
R4 R11 R22-R33 R38 = Arduino-rcl:R: SMD Resistor; CODE-ARDUINO: 0049; DATASHEET: http://www.yageo.com/documents/recent/PYu-RC_Group_51_RoHS_L_10.pdf; DISTRIBUTOR-LINK: https://www.digikey.com/product-detail/en/yageo/RC0603FR-07330RL/311-330HRCT-ND/730109; DISTRIBUTOR-PN: 311-330HRCT-ND; MANUFACTURER: Yageo; MANUFACTURER-PN: RC0603FR-07330RL; NOTE: NO; PN-ALTERNATIVE1: -
R7 = Arduino-rcl:R: SMD Resistor; CODE-ARDUINO: A5459; DATASHEET: https://industrial.panasonic.com/cdbs/www-data/pdf/RDA0000/AOA0000C304.pdf; DISTRIBUTOR-LINK: https://www.digikey.com/product-detail/en/yageo/RC0603FR-0752K3L/311-52.3KHRCT-ND/730237; DISTRIBUTOR-PN: 311-52.3KHRCT-ND; MANUFACTURER: Yageo; MANUFACTURER-PN: RC0603FR-0752K3L; NOTE: 1% ONLY; PN-ALTERNATIVE1: -; VALUE: 52k3
R15 = Arduino-rcl:4R-N: Array Chip Resistor Source: RS Component / Phycomp; CODE-ARDUINO: 0540; DATASHEET: http://www.bourns.com/docs/Product-Datasheets/CATCAY.pdf; DISTRIBUTOR-LINK: https://www.digikey.com/product-detail/en/bourns-inc/CAY16-471J4LF/CAY16-471J4LFCT-ND/3437962; DISTRIBUTOR-PN: CAY16-471J4LFCT-ND; MANUFACTURER: Bourns Inc.; MANUFACTURER-PN: CAY16-471J4LF; RESTRICTIONS: NO
R16 R17 = Resistenze:0180_52K3_0603: 52k3 0603; CASE: 0603; MONTHLY_USAGE: _____; PART_NUMBER: 52k3_0603; PRICE: _____; SUPPLIER: _____; TYPE: Resistenze; VALUE: 52k3
R18 R19 = Resistenze:0176_39_R_0603: 39R 0603; CASE: 0603; MONTHLY_USAGE: _____; PART_NUMBER: 39_R_0603; PRICE: _____; SUPPLIER: _____; TYPE: Resistenze
R20 = Resistenze:0164_6K8_0603: 6K8 0603; CASE: 0603; MONTHLY_USAGE: _____; PART_NUMBER: 6K8_0603; PRICE: _____; SUPPLIER: _____; TYPE: Resistenze
R21 = Arduino-rcl:R: SMD Resistor; CODE-ARDUINO: 0233; DATASHEET: http://www.yageo.com/exep/pages/download/literatures/PYu-R_Marking_2.pdf; DISTRIBUTOR-LINK: https://www.digikey.com/product-detail/en/yageo/RC0603JR-070RL/311-0.0GRCT-ND/729622; DISTRIBUTOR-PN: 311-0.0GRCT-ND; MANUFACTURER: Yageo; MANUFACTURER-PN: RC0603JR-070RL; NOTE: NO; PN-ALTERNATIVE1: -
RESET = Arduino-pushbuttons:TACTILE2: Pushbutton; CODE-ARDUINO: 0946; DATASHEET: http://www.mouser.com/ds/2/418/NG_CD_1571636_C1-122399.pdf; DISTRIBUTOR-LINK: https://www.mouser.it/ProductDetail/TE-Connectivity/1571636-3/?qs=%2fha2pyFaduiys%2fNUBzym%252bcoSb9tuK3Sjuv54qjf0hQ0%3d; DISTRIBUTOR-PN: 506-1571636-3; MANUFACTURER: TE; MANUFACTURER-PN: 1571636-3; PN-ALTERNATIVE1: TS42031-160WWS027260
TP_EDBG_FORCE_BOOT TP_GND = SmartPrj:TP_SP
TR1 TR2 = Arduino-transistors:PMV48XP: 20 V, 3.5 A P-channel Trench MOSFET - PMV48XP; CODE-ARDUINO: 1039; DATASHEET: https://assets.nexperia.com/documents/data-sheet/PMV48XP.pdf; DISTRIBUTOR-LINK: https://www.digikey.com/product-detail/en/nexperia-usa-inc/PMV48XP215/1727-5907-1-ND/2744665; DISTRIBUTOR-PN: 1727-5907-1-ND; MANUFACTURER: Nexperia; MANUFACTURER-PN: PMV48XP,215; PN-ALTERNATIVE: FDN340P; PN-ALTERNATIVE2: IRLML6402TRPBF
TR3 TR7 TR8 = Arduino-transistors:2N7002T: MOSFET N-CH 60V 115MA; CODE-ARDUINO: 1612; DATASHEET: http://www.mccsemi.com/up_pdf/2N7002(SOT-23).PDF; DISTRIBUTOR-LINK: https://www.digikey.com/product-detail/it/micro-commercial-co/2N7002-TP/2N7002-TPMSCT-ND/1960099; DISTRIBUTOR-PN: 2N7002-TPMSCT-ND; MANUFACTURER: Micro Commercial Co; MANUFACTURER-PN: 2N7002-TP
U1 = Arduino-ucs&SoCs:ATSAMD21G18A-48: ARM® Cortex®-M0+ SAM D21G Microcontroller IC 32-Bit 48MHz 256KB (256K x 8) FLASH 48-TQFP (7x7); CODE-ARDUINO: ATSAMD21G18A-MU; DATASHEET: http://www.atmel.com/Images/Atmel-42181-SAM-D21_Datasheet.pdf; DISTRIBUTOR-LINK: https://www.digikey.com/product-detail/en/microchip-technology/ATSAMD21G18A-MU/ATSAMD21G18A-MU-ND/4935894; DISTRIBUTOR-PN: ATSAMD21G18A-MU-ND; MANUFACTURER: Atmel; MANUFACTURER-PN: ATSAMD21G18A-MU
U2 = Arduino-ICs:LDO: LDO; CODE-ARDUINO: 0045; DATASHEET: https://media.digikey.com/pdf/Data%20Sheets/NXP%20PDFs/NX1117C(E).pdf; DISTRIBUTOR-LINK: https://www.digikey.com/product-detail/en/nxp-usa-inc/NX1117CE33Z,115/568-8443-1-ND/2765160; DISTRIBUTOR-PN: 568-8443-1-ND; MANUFACTURER: NXP; MANUFACTURER-PN: NX1117CE33Z,115; NOTE: NO
U$4-U$6 = Arduino-utility:A3-FRAME; CODE-ARDUINO: DNP; DATASHEET: DNP; DISTRIBUTOR-LINK: DNP; DISTRIBUTOR-PN: DNP; MANUFACTURER: DNP; MANUFACTURER-PN: DNP; NOTE: DNP
X3 = Cristalli:0396_12MHZ-12PF-K7: 12Mhz - K7 12pF - SMD
Y4 = Arduino-crystals:32.768KHZ: LF crystal; CODE-ARDUINO: 0213; DATASHEET: http://www.abracon.com/Resonators/ABS07.pdf; DISTRIBUTOR-LINK: http://www.digikey.com/product-detail/en/abracon-llc/ABS07-32.768KHZ-T/535-9542-1-ND/1237009; DISTRIBUTOR-PN: 535-9542-1-ND; MANUFACTURER: Abracon LLC; MANUFACTURER-PN: ABS07-32.768KHZ-T
Z3-Z6 = Arduino-rcl:VARISTOR: Varistors; CODE-ARDUINO: 0010; CODE-TK2: CG0603MLC-05E; DATASHEET: http://www.bourns.com/data/global/pdfs/MLC.pdf; DISTRIBUTOR-LINK: https://www.digikey.com/product-detail/it/bourns-inc/CG0603MLC-05E/CG0603MLC-05ECT-ND/3438061; DISTRIBUTOR-PN: CG0603MLC-05ETR-ND; MANUFACTURER: Bourns; MANUFACTURER-PN: CG0603MLC-05E; NOTE: NO

## Net classes
0 default: width 0.127 mm, drill 0.2 mm, clearance 0.076 mm
1 USB: width 0.127 mm, drill 0.2 mm, clearance 0.178 mm
2 gnd: width 0.127 mm, drill 0.2 mm, clearance 0.178 mm
3 usbvcc: width 0.127 mm, drill 0.2 mm, clearance 0.178 mm
4 USBpair: width 0.127 mm, drill 0.2 mm, clearance 0.076 mm to class 0